# EasyEDA schematic SCH_NeuroMems_V2.10_2025-06-07.json
REV: 1.0; Sheet: 1/1
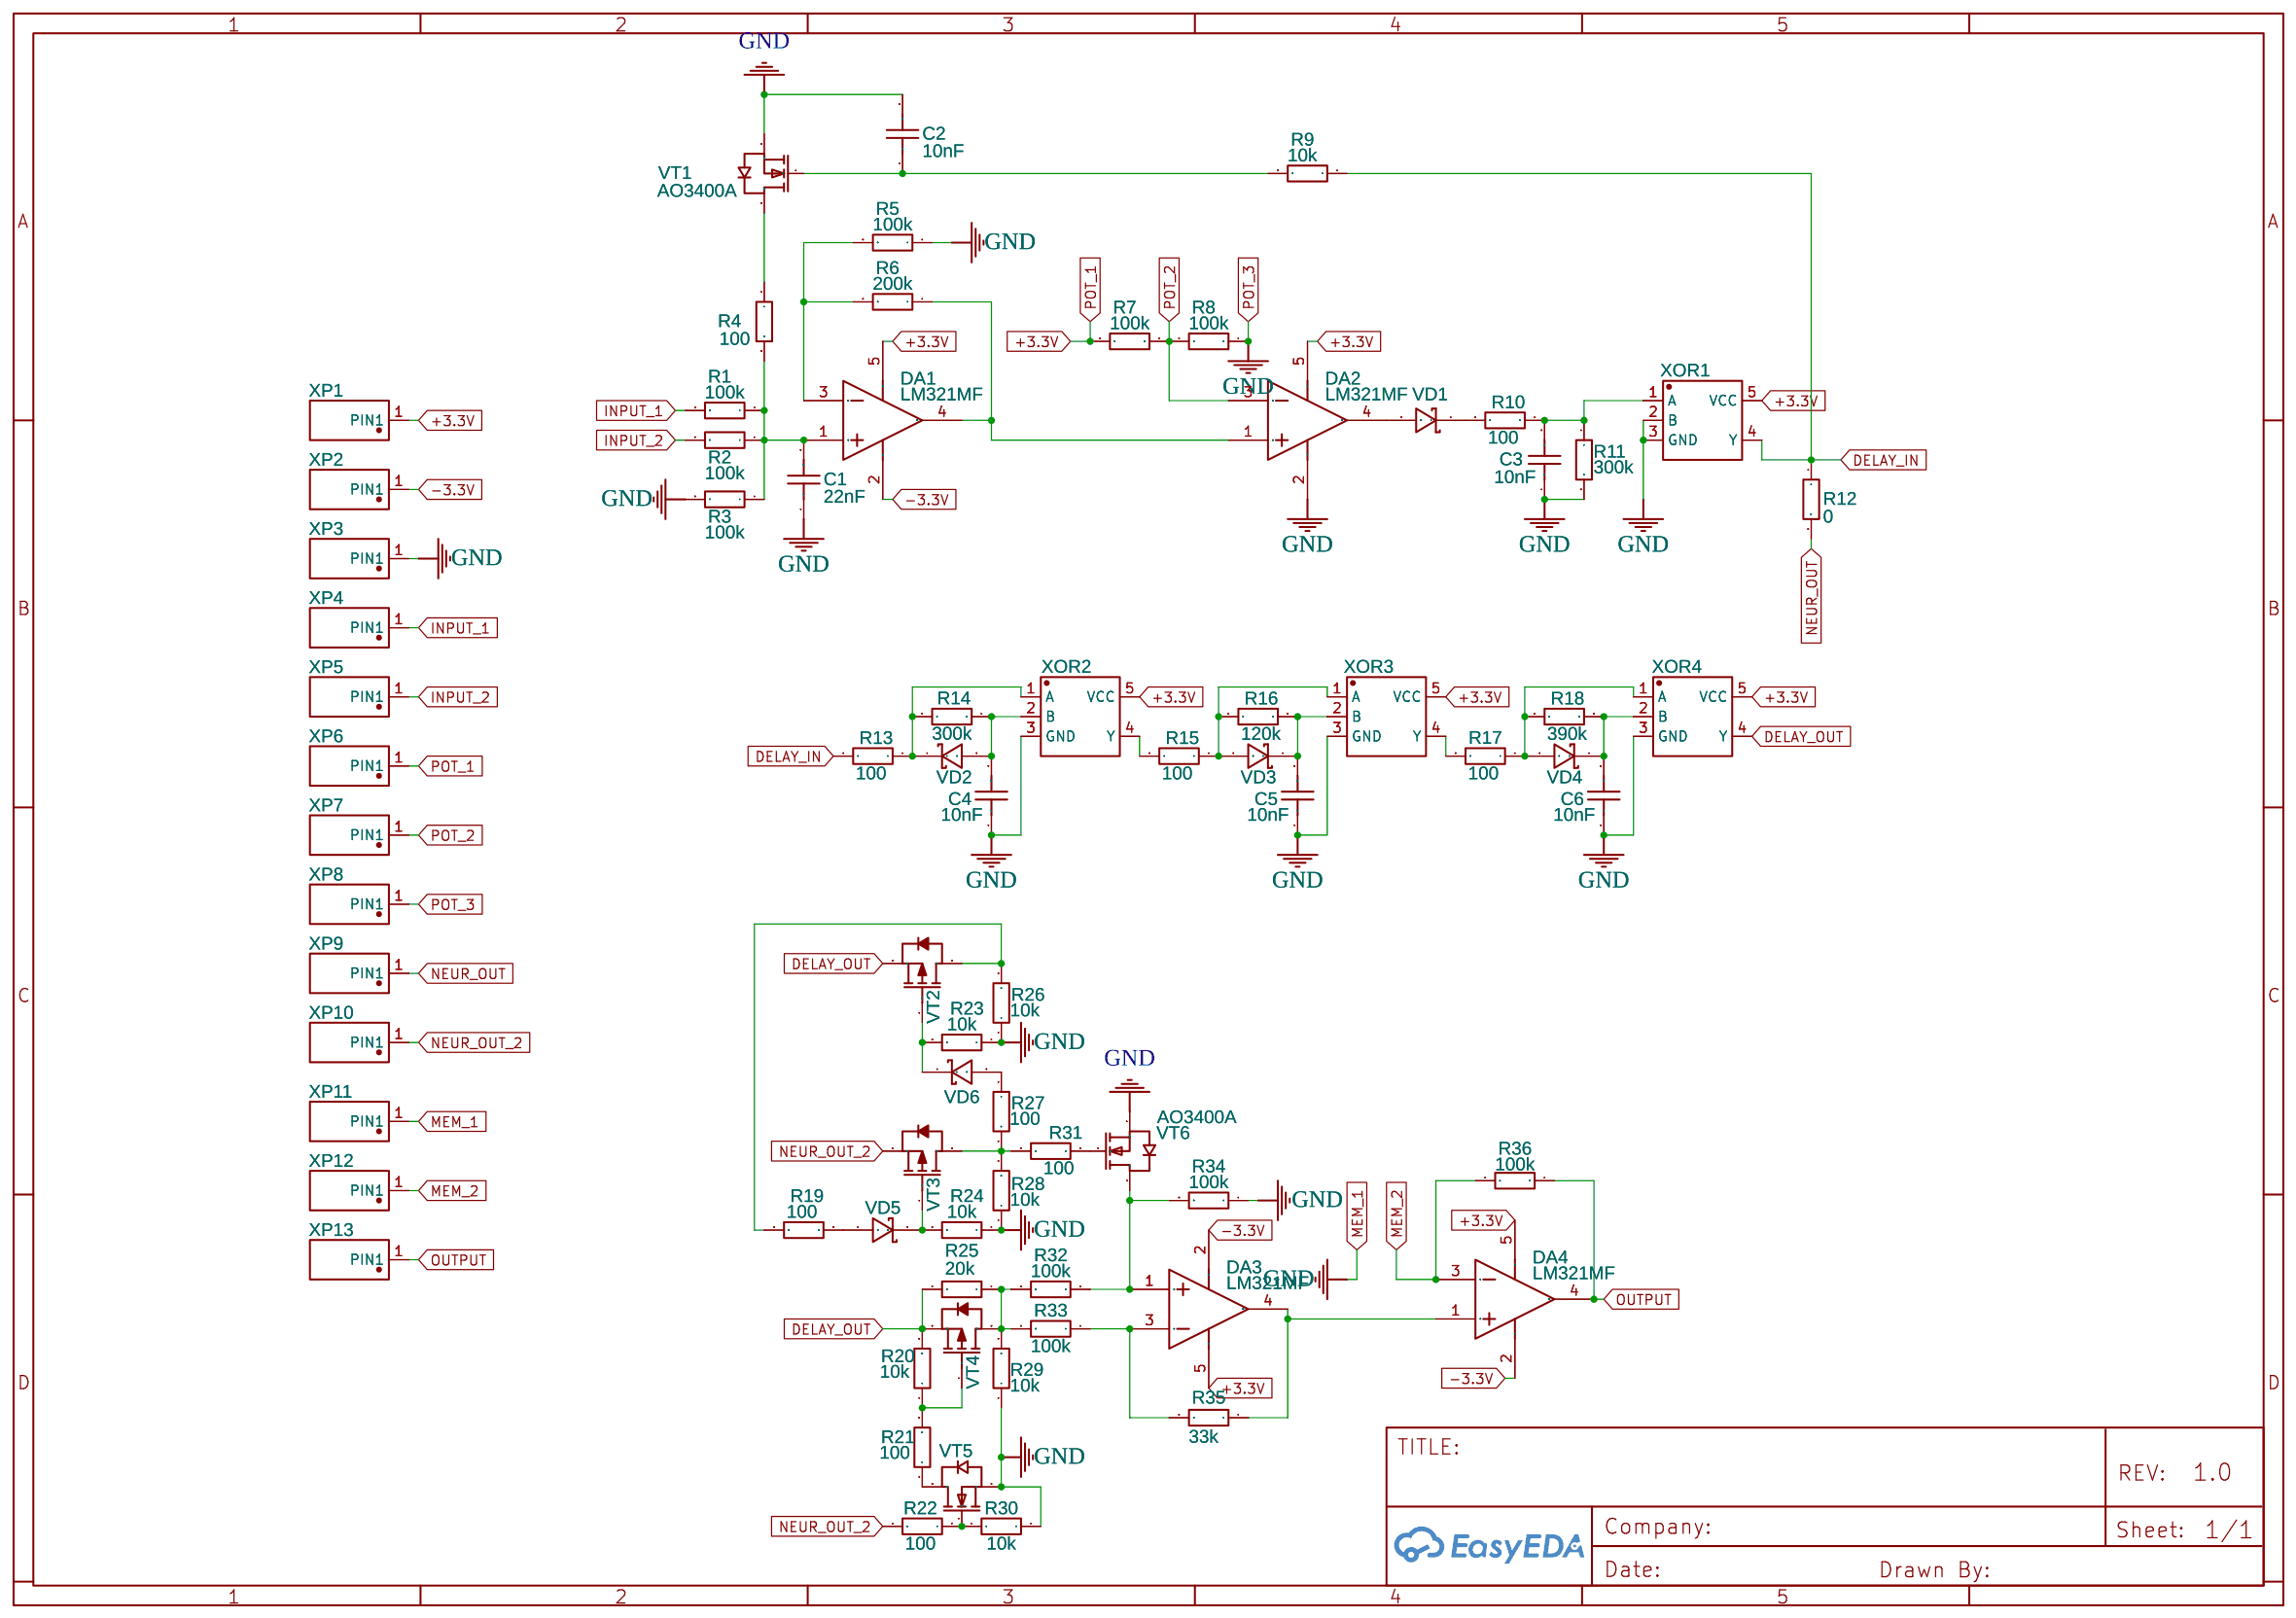
[diagram p0: schematic sheet]

## Parts
C1  22nF  [C0402]
C2  10nF  [C0201]
C3  10nF  [C0402]
C4  10nF  [C0402]
C5  10nF  [C0402]
C6  10nF  [C0402]
DA1  LM321MF  [SOT-23-5_L3.0-W1.7-P0.95-LS2.8-BR]
DA2  LM321MF  [SOT-23-5_L3.0-W1.7-P0.95-LS2.8-BR]
DA3  LM321MF  [SOT-23-5_L3.0-W1.7-P0.95-LS2.8-BR]
DA4  LM321MF  [SOT-23-5_L3.0-W1.7-P0.95-LS2.8-BR]
R1  100k  [R0201]
R2  100k  [R0201]
R3  100k  [R0201]
R4  100  [R0201]
R5  100k  [R0201]
R6  200k  [R0201]
R7  100k  [R0201]
R8  100k  [R0201]
R9  10k  [R0201]
R10  100  [R0201]
R11  300k  [R0201]
R12  0  [R0201]
R13  100  [R0201]
R14  300k  [R0201]
R15  100  [R0201]
R16  120k  [R0201]
R17  100  [R0201]
R18  390k  [R0201]
R19  100  [R0201]
R20  10k  [R0201]
R21  100  [R0201]
R22  100  [R0201]
R23  10k  [R0201]
R24  10k  [R0201]
R25  20k  [R0201]
R26  10k  [R0201]
R27  100  [R0201]
R28  10k  [R0201]
R29  10k  [R0201]
R30  10k  [R0201]
R31  100  [R0201]
R32  100k  [R0201]
R33  100k  [R0201]
R34  100k  [R0201]
R35  33k  [R0201]
R36  100k  [R0201]
VD1  1N5817WS  [SOD-323_L1.8-W1.3-LS2.5-RD]
VD2  1N5817WS  [SOD-323_L1.8-W1.3-LS2.5-RD]
VD3  1N5817WS  [SOD-323_L1.8-W1.3-LS2.5-RD]
VD4  1N5817WS  [SOD-323_L1.8-W1.3-LS2.5-RD]
VD5  1N5817WS  [SOD-323_L1.8-W1.3-LS2.5-RD]
VD6  1N5817WS  [SOD-323_L1.8-W1.3-LS2.5-RD]
VT1  AO3400A  [SOT-23_L2.9-W1.3-P1.90-LS2.4-BR]
VT2  AO3401A  [SOT-23_L2.9-W1.3-P1.90-LS2.4-BR]
VT3  AO3401A  [SOT-23_L2.9-W1.3-P1.90-LS2.4-BR]
VT4  AO3401A  [SOT-23_L2.9-W1.3-P1.90-LS2.4-BR]
VT5  AO3400A  [SOT-23_L2.9-W1.3-P1.90-LS2.4-BR]
VT6  AO3400A  [SOT-23_L2.9-W1.3-P1.90-LS2.4-BR]
XOR1  SN74AHC1G86DBVR  [SOT-23-5_L3.0-W1.7-P0.95-LS2.8-BR]
XOR2  SN74AHC1G86DBVR  [SOT-23-5_L3.0-W1.7-P0.95-LS2.8-BR]
XOR3  SN74AHC1G86DBVR  [SOT-23-5_L3.0-W1.7-P0.95-LS2.8-BR]
XOR4  SN74AHC1G86DBVR  [SOT-23-5_L3.0-W1.7-P0.95-LS2.8-BR]
XP1  PLS-01 COPY  [MALE PLS40X1]
XP2  PLS-01 COPY  [MALE PLS40X1]
XP3  PLS-01 COPY  [MALE PLS40X1]
XP4  PLS-01 COPY  [MALE PLS40X1]
XP5  PLS-01 COPY  [MALE PLS40X1]
XP6  PLS-01 COPY  [MALE PLS40X1]
XP7  PLS-01 COPY  [MALE PLS40X1]
XP8  PLS-01 COPY  [MALE PLS40X1]
XP9  PLS-01 COPY  [MALE PLS40X1]
XP10  PLS-01 COPY  [MALE PLS40X1]
XP11  PLS-01 COPY  [MALE PLS40X1]
XP12  PLS-01 COPY  [MALE PLS40X1]
XP13  PLS-01 COPY  [MALE PLS40X1]

## Library data of the parts
C1 C3-C6 = GRM155R71E103KA01D | SMD CERAMIC CAPACITOR: Supplier: LCSC; Supplier Part: C29020409; Manufacturer: null; Manufacturer Part: GRM155R71E103KA01D | SMD Ceramic Capacitor; Contributor: lcsc
C2 = 0201_C9900015864: Contributor: lcsc; Supplier: LCSC; Supplier Part: C9900015864; Manufacturer: null; Manufacturer Part: 0201; JLCPCB Part Class: Extended Part
DA1-DA4 = LM321MF/NOPB: Contributor: LCSC; Supplier: LCSC; Supplier Part: C131103; Manufacturer: TI(德州仪器); JLCPCB Part Class: Extended Part
R1-R36 = 0201: Contributor: lcsc; Supplier: LCSC; Supplier Part: C9900015843; Manufacturer: null; JLCPCB Part Class: Extended Part
VD1-VD6 = 1N5817WS: Contributor: LCSC; Supplier: LCSC; Supplier Part: C489146; Manufacturer: KEXIN(科信); JLCPCB Part Class: Extended Part
VT1 VT5 VT6 = AO3400A_C344010: Contributor: LCSC; Supplier: LCSC; Supplier Part: C344010; Manufacturer: BORN(伯恩半导体); JLCPCB Part Class: Extended Part
VT2-VT4 = AO3401A: Supplier: LCSC; Manufacturer: AOS; Supplier Part: C15127; JLCPCB Part Class: Basic Part
XOR1-XOR4 = SN74AHC1G86DBVR: Supplier: LCSC; Manufacturer: TI(德州仪器); Supplier Part: C7471; JLCPCB Part Class: Extended Part
XP1-XP13 = PLS-01 COPY: Contributor: Alexus-12

## Nets
+3.3V: DA1.5(V+) DA2.5(V+) DA3.5(V+) DA4.5(V+) R7.2 XOR1.5(VCC) XOR2.5(VCC) XOR3.5(VCC) XOR4.5(VCC) XP1.1(PIN1) XP6.1(PIN1)
-3.3V: DA1.2(V-) DA3.2(V-) DA4.2(V-) XP2.1(PIN1)
GND: C1.1 C2.2 C3.1 C4.1 C5.1 C6.1 DA2.2(V-) R3.2 R5.1 R8.1 R11.2 R23.1 R24.1 R26.1 R28.1 R29.1 R30.1 R34.1 VT1.2(S) VT5.2(S) VT6.2(S) XOR1.2(B) XOR1.3(GND) XOR2.3(GND) XOR3.3(GND) XOR4.3(GND) XP3.1(PIN1) XP8.1(PIN1) XP11.1(PIN1)
DELAY_IN: R9.1 R12.1 R13.2 XOR1.4(Y)
DELAY_OUT: R20.2 R25.2 VT2.2(S) VT4.2(S) XOR4.4(Y)
INPUT_1: R1.2 XP4.1(PIN1)
INPUT_2: R2.2 XP5.1(PIN1)
MEM_2: DA4.3(IN-) R36.2 XP12.1(PIN1)
NEUR_OUT: R12.2 XP9.1(PIN1)
NEUR_OUT_2: R22.2 VT3.2(S) XP10.1(PIN1)
OUTPUT: DA4.4(OUT) R36.1 XP13.1(PIN1)
POT_2: DA2.3(IN-) R7.1 R8.2 XP7.1(PIN1)
Net-(C1-2): C1.2 DA1.1(IN+) R1.1 R2.1 R3.1 R4.2
Net-(C2-1): C2.1 R9.2 VT1.1(G)
Net-(C3-2): C3.2 R10.1 R11.1 XOR1.1(A)
Net-(C4-2): C4.2 R14.1 VD2.2 XOR2.2(B)
Net-(C5-2): C5.2 R16.1 VD3.1 XOR3.2(B)
Net-(C6-2): C6.2 R18.1 VD4.1 XOR4.2(B)
Net-(DA1-3): DA1.3(IN-) R5.2 R6.2
Net-(DA1-4): DA1.4(OUT) DA2.1(IN+) R6.1
Net-(DA2-4): DA2.4(OUT) VD1.2
Net-(DA3-1): DA3.1(IN+) R32.1 R34.2 VT6.3(D)
Net-(DA3-3): DA3.3(IN-) R33.1 R35.2
Net-(DA3-4): DA3.4(OUT) DA4.1(IN+) R35.1
Net-(R4-1): R4.1 VT1.3(D)
Net-(R10-2): R10.2 VD1.1
Net-(R13-1): R13.1 R14.2 VD2.1 XOR2.1(A)
Net-(R15-1): R15.1 R16.2 VD3.2 XOR3.1(A)
Net-(R15-2): R15.2 XOR2.4(Y)
Net-(R17-1): R17.1 R18.2 VD4.2 XOR4.1(A)
Net-(R17-2): R17.2 XOR3.4(Y)
Net-(R19-1): R19.1 R26.2 VT2.3(D)
Net-(R19-2): R19.2 VD5.2
Net-(R20-1): R20.1 R21.2 VT4.1(G)
Net-(R21-1): R21.1 VT5.3(D)
Net-(R22-1): R22.1 R30.2 VT5.1(G)
Net-(R23-2): R23.2 VD6.1 VT2.1(G)
Net-(R24-2): R24.2 VD5.1 VT3.1(G)
Net-(R25-1): R25.1 R29.2 R32.2 R33.2 VT4.3(D)
Net-(R27-1): R27.1 VD6.2
Net-(R27-2): R27.2 R28.2 R31.1 VT3.3(D)
Net-(R31-2): R31.2 VT6.1(G)
